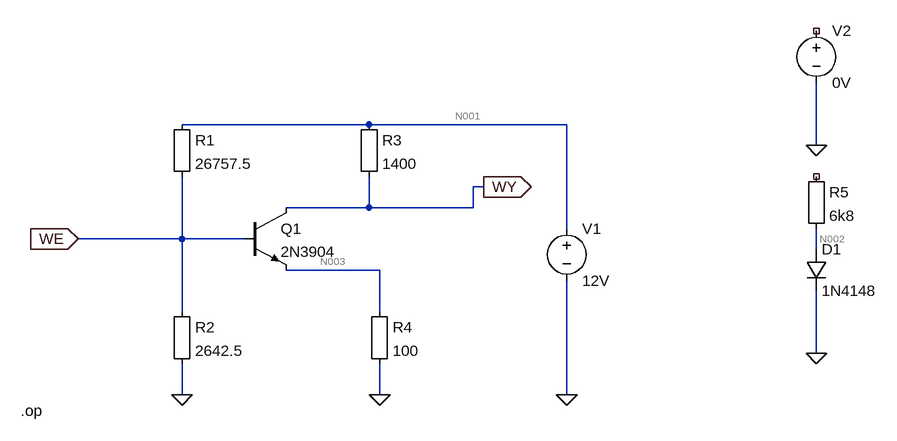
[diagram p0: schematic v1.asc]
v1.asc, the LTspice schematic file:
Version 4.1
SHEET 1 1256 680
WIRE 464 32 176 32
WIRE 768 32 464 32
WIRE 1152 64 1152 -32
WIRE 640 128 624 128
WIRE 464 160 464 112
WIRE 464 160 336 160
WIRE 624 160 624 128
WIRE 624 160 464 160
WIRE 768 192 768 32
WIRE 176 208 176 112
WIRE 176 208 16 208
WIRE 272 208 176 208
WIRE 1152 224 1152 192
WIRE 480 256 336 256
WIRE 176 320 176 208
WIRE 480 320 480 256
WIRE 1152 384 1152 288
WIRE 176 448 176 400
WIRE 480 448 480 400
WIRE 768 448 768 272
FLAG 176 448 0
FLAG 480 448 0
FLAG 768 448 0
FLAG 16 208 WE
IOPIN 16 208 In
FLAG 640 128 WY
IOPIN 640 128 Out
FLAG 1152 384 0
FLAG 1152 64 0
DATAFLAG 224 208 "$-V(N003)"
DATAFLAG 496 160 "$-V(N003)"
SYMBOL npn 272 160 R0
SYMATTR InstName Q1
SYMATTR Value 2N3904
SYMBOL Misc\\EuropeanResistor 160 16 R0
SYMATTR InstName R1
SYMATTR Value 26757.5
SYMBOL Misc\\EuropeanResistor 160 304 R0
SYMATTR InstName R2
SYMATTR Value 2642.5
SYMBOL Misc\\EuropeanResistor 448 16 R0
SYMATTR InstName R3
SYMATTR Value 1400
SYMBOL Misc\\EuropeanResistor 464 304 R0
SYMATTR InstName R4
SYMATTR Value 100
SYMBOL voltage 768 176 R0
WINDOW 123 0 0 Left 0
WINDOW 39 0 0 Left 0
SYMATTR InstName V1
SYMATTR Value 12V
SYMBOL Misc\\EuropeanResistor 1136 96 R0
SYMATTR InstName R5
SYMATTR Value 6k8
SYMBOL diode 1136 224 R0
SYMATTR InstName D1
SYMATTR Value 1N4148
SYMBOL voltage 1152 -128 R0
WINDOW 123 0 0 Left 0
WINDOW 39 0 0 Left 0
SYMATTR InstName V2
SYMATTR Value 0V
TEXT -72 472 Left 2 !.op

The netlist it stands for:
* v1.asc
Q1 WY WE N003 0 2N3904
R1 N001 WE 26757.5
R2 WE 0 2642.5
R3 N001 WY 1400
R4 N003 0 100
V1 N001 0 12V
R5 NC_01 N002 6k8
D1 N002 0 1N4148
V2 NC_02 0 0V
.model D D
.lib standard.dio
.model NPN NPN
.model PNP PNP
.lib standard.bjt
.op
.backanno
.end

* Results of the author's LTspice run, read from the files saved beside the schematic
* Operating Point:
*   V(n001) = 12 V
*   V(n002) = 0 V
*   V(n003) = 363.2 mV
*   V(we) = 1.051 V
*   V(wy) = 6.931 V
*   I(D1) = 0 A
*   I(R1) = 409.2 µA
*   I(R2) = 397.7 µA
*   I(R3) = 3.62 mA
*   I(R4) = 3.632 mA
*   I(R5) = 0 A
*   I(V1) = -4.03 mA
*   I(V2) = 0 A
*   Ib(Q1) = 11.5 µA
*   Ic(Q1) = 3.62 mA
*   Ie(Q1) = -3.632 mA
*   Is(Q1) = 0 A